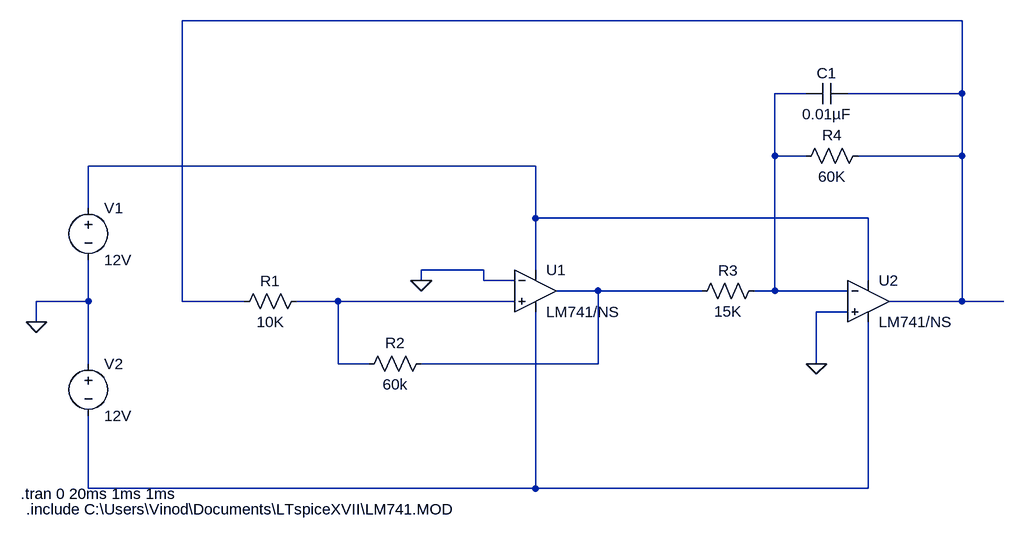
[diagram p0: schematic Waveform Generator.asc]
Waveform Generator.asc, the LTspice schematic file:
Version 4
SHEET 1 932 680
WIRE 64 -432 -1136 -432
WIRE -176 -320 -224 -320
WIRE 64 -320 64 -432
WIRE 64 -320 -112 -320
WIRE -224 -224 -224 -320
WIRE -176 -224 -224 -224
WIRE 64 -224 64 -320
WIRE 64 -224 -96 -224
WIRE -592 -208 -1280 -208
WIRE -1280 -144 -1280 -208
WIRE -592 -128 -592 -208
WIRE -80 -128 -592 -128
WIRE -672 -48 -768 -48
WIRE -592 -48 -592 -128
WIRE -768 -32 -768 -48
WIRE -672 -32 -672 -48
WIRE -624 -32 -672 -32
WIRE -80 -32 -80 -128
WIRE -496 -16 -560 -16
WIRE -336 -16 -496 -16
WIRE -224 -16 -224 -224
WIRE -224 -16 -256 -16
WIRE -112 -16 -224 -16
WIRE -1280 0 -1280 -64
WIRE -1280 0 -1360 0
WIRE -1136 0 -1136 -432
WIRE -1040 0 -1136 0
WIRE -896 0 -960 0
WIRE -624 0 -896 0
WIRE 64 0 64 -224
WIRE 64 0 -48 0
WIRE 128 0 64 0
WIRE -112 16 -160 16
WIRE -1360 32 -1360 0
WIRE -1280 96 -1280 0
WIRE -896 96 -896 0
WIRE -848 96 -896 96
WIRE -496 96 -496 -16
WIRE -496 96 -768 96
WIRE -160 96 -160 16
WIRE -1280 288 -1280 176
WIRE -592 288 -592 16
WIRE -592 288 -1280 288
WIRE -80 288 -80 32
WIRE -80 288 -592 288
FLAG -1360 32 0
FLAG -768 -32 0
FLAG -160 96 0
SYMBOL res -944 -16 R90
WINDOW 0 0 56 VBottom 2
WINDOW 3 32 56 VTop 2
SYMATTR InstName R1
SYMATTR Value 10K
SYMBOL res -752 80 R90
WINDOW 0 0 56 VBottom 2
WINDOW 3 32 56 VTop 2
SYMATTR InstName R2
SYMATTR Value 60k
SYMBOL res -240 -32 R90
WINDOW 0 0 56 VBottom 2
WINDOW 3 32 56 VTop 2
SYMATTR InstName R3
SYMATTR Value 15K
SYMBOL cap -112 -336 R90
WINDOW 0 0 32 VBottom 2
WINDOW 3 32 32 VTop 2
SYMATTR InstName C1
SYMATTR Value 0.01µF
SYMBOL voltage -1280 -160 R0
SYMATTR InstName V1
SYMATTR Value 12V
SYMBOL voltage -1280 80 R0
SYMATTR InstName V2
SYMATTR Value 12V
SYMBOL res -80 -240 R90
WINDOW 0 0 56 VBottom 2
WINDOW 3 32 56 VTop 2
SYMATTR InstName R4
SYMATTR Value 60K
SYMBOL OpAmps\\opamp2 -592 -80 R0
SYMATTR InstName U1
SYMATTR Value LM741/NS
SYMBOL OpAmps\\opamp2 -80 -64 R0
SYMATTR InstName U2
SYMATTR Value LM741/NS
TEXT -1384 296 Left 2 !.tran 0 20ms 1ms 1ms
TEXT -1376 320 Left 2 !.include C:\\Users\\Vinod\\Documents\\LTspiceXVII\\LM741.MOD

The netlist it stands for:
* Waveform Generator.asc
R1 N005 N001 10K
R2 N004 N005 60k
R3 N002 N004 15K
C1 N001 N002 0.01µF
V1 N003 0 12V
V2 0 N006 12V
R4 N001 N002 60K
XU1 N005 0 N003 N006 N004 LM741/NS  ; pins In+ In- V+ V- OUT
XU2 0 N002 N003 N006 N001 LM741/NS  ; pins In+ In- V+ V- OUT
.tran 0 20ms 1ms 1ms
.include C:\Users\Vinod\Documents\LTspiceXVII\LM741.MOD
.backanno
.end